# EAGLE schematic schematic (EAGLE 6.5.0)
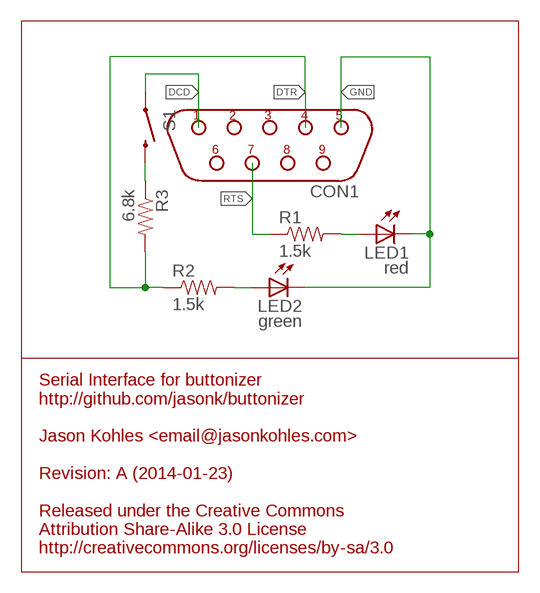
[diagram p0: schematic, sheet 1]

## Parts
CON1  DB9F  [D-09F]
LED1  red  LED5MM  [LED5MM]
LED2  green  LED5MM  [LED5MM]
R1  1.5k  RESISTORPTH-1/2W  [AXIAL-0.5]
R2  1.5k  RESISTORPTH-1/2W  [AXIAL-0.5]
R3  6.8k  RESISTORPTH-1/2W  [AXIAL-0.5]
S1  SWITCH-MOMENTARY-212MM  [TACTILE-PTH-12MM]

## Nets
DCD: CON1.1 S1.1
DTR: CON1.4 R2.P$1 R3.P$2
GND: CON1.5 LED1.K(C) LED2.K(C)
N$1: LED1.A R1.P$2
N$3: LED2.A R2.P$2
N$4: R3.P$1 S1.3
RTS: CON1.7 R1.P$1
Unconnected: CON1.2 CON1.3 CON1.6 CON1.8 CON1.9

## Notes on the sheet
- Serial Interface for buttonizer
  http://github.com/jasonk/buttonizer
  
  Jason Kohles <email@jasonkohles.com>
  
  Revision: A (2014-01-23)
  
  Released under the Creative Commons
  Attribution Share-Alike 3.0 License
  http://creativecommons.org/licenses/by-sa/3.0

## Library data of the parts
CON1 = connect:DB9F
LED1 LED2 = SparkFun:LED: LEDs Standard schematic elements and footprints for 5mm, 3mm, 1206, and 0603 sized LEDs. 5mm - Spark Fun Electronics SKU : COM-00529 (and others)
R1-R3 = SparkFun:RESISTOR: Resistor Basic schematic elements and footprints for 0603, 1206, and PTH resistors.
S1 = SparkFun:SWITCH-MOMENTARY-2